# Altium schematic sheet Barometer.SchDoc
size Letter
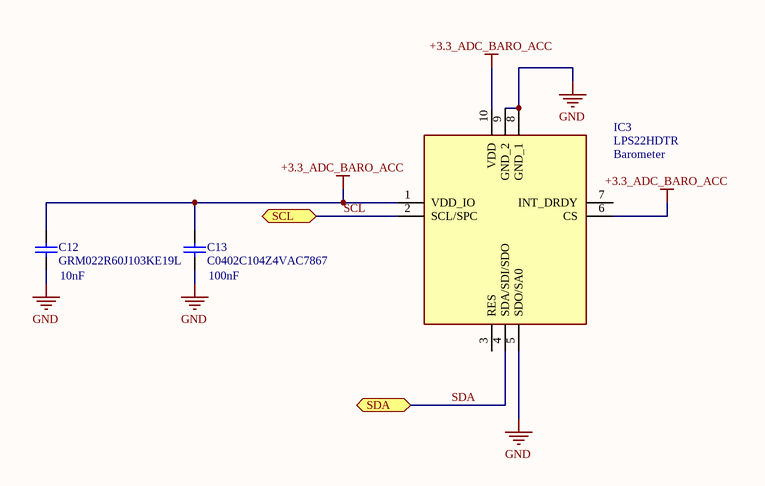
[diagram p0: Barometer.SchDoc]

## Parts
C12  GRM022R60J103KE19L  Spec: 10nF  [CAPC1005X55X25NL05T10]
C13  C0402C104Z4VAC7867  Spec: 100nF  [CAPC1005X60X30LL05T10]
IC3  LPS22HDTR  [LPS22HDTR]

## Ports
SCL (bidir), SDA (bidir)

## Nets
+3.3_ADC_BARO_ACC: C12.2 C13.2 IC3.1(VDD_IO) IC3.6(CS) IC3.10(VDD)
GND: C12.1 C13.1 IC3.5(SDO/SA0) IC3.8(GND_1) IC3.9(GND_2)
SCL: IC3.2(SCL/SPC) ; port SCL
SDA: IC3.4(SDA/SDI/SDO) ; port SDA

Not connected (* = marked no-connect by the designer): IC3 3(RES) 7(INT_DRDY)

## Notes on the sheet
- (near IC3) Barometer
- Title
- Size:
- Date:
- Letter
- Number:
- Time:
- Revision:
- Sheet
- of
- Rocket Propulsion Laboratory
- UC San Diego
- Avionics Team
- Author :
- File:

## Library data of the parts
C12 = CMP-2008-04044-1: Manufacturer: Murata; Part Number: GRM022R60J103KE19L
C13 = CMP-2008-02369-1: Manufacturer: Kemet; Part Number: C0402C104Z4VAC7867
IC3 = LPS22HDTR: Integrated Circuit; Manufacturer_Name: STMicroelectronics; Datasheet Link: https://www.st.com/resource/en/datasheet/lps22hd.pdf; Height: 0.8mm; Manufacturer_Part_Number: LPS22HDTR; Arrow Part Number: LPS22HDTR; Arrow Price/Stock: https://www.arrow.com/en/products/lps22hdtr/stmicroelectronics; Mouser Part Number: 511-LPS22HDTR; Mouser Price/Stock: https://www.mouser.co.uk/ProductDetail/STMicroelectronics/LPS22HDTR?qs=qVqInAHJvrZgdoVrJXJCrw%3D%3D